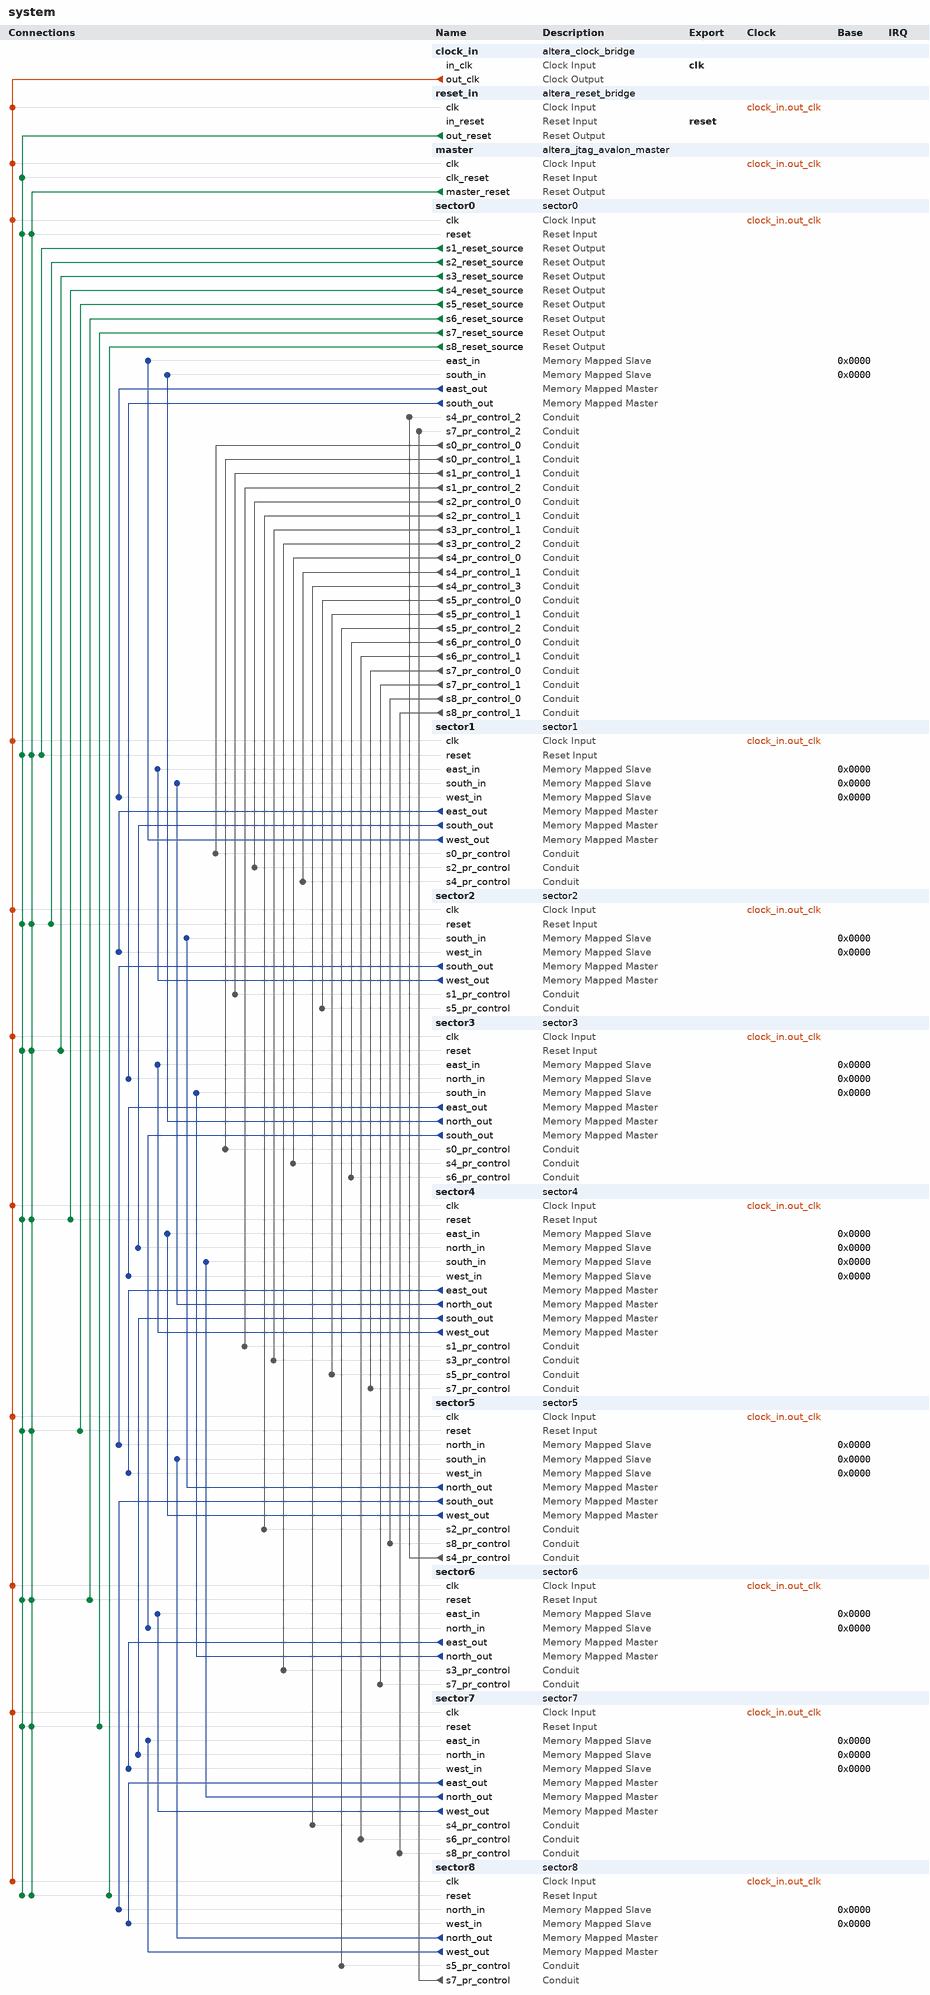
[diagram p0: system contents]
# Platform Designer (Qsys) system system, Stratix 10 1SG280HU2F50E2VGS1
# Parameters at their usual value, and those the tool derives, are not listed.
package require -exact qsys 1.0
create_system system
set_project_property DEVICE_FAMILY {Stratix 10}
set_project_property DEVICE 1SG280HU2F50E2VGS1

add_component clock_in ip/system/system_clock_in.ip altera_clock_bridge clock_in 18.0
load_component clock_in
set_component_parameter_value DERIVED_CLOCK_RATE 0
set_component_parameter_value EXPLICIT_CLOCK_RATE 50000000
save_component

add_component reset_in ip/system/system_reset_bridge_0.ip altera_reset_bridge reset_in 18.0
load_component reset_in
set_component_parameter_value ACTIVE_LOW_RESET 1
set_component_parameter_value SYNCHRONOUS_EDGES deassert
set_component_parameter_value SYNC_RESET 0
save_component

add_component master ip/system/system_master_1.ip altera_jtag_avalon_master master 18.0
load_component master
save_component

add_component sector0 sector0.qsys sector0 sector0 

add_component sector1 sector1.qsys sector1 sector1 

add_component sector2 sector2.qsys sector2 sector2 

add_component sector3 sector3.qsys sector3 sector3 

add_component sector4 sector4.qsys sector4 sector4 

add_component sector5 sector5.qsys sector5 sector5 

add_component sector6 sector6.qsys sector6 sector6 

add_component sector7 sector7.qsys sector7 sector7 

add_component sector8 sector8.qsys sector8 sector8 

# connections
add_connection clock_in.out_clk master.clk clock
add_connection clock_in.out_clk reset_in.clk clock
add_connection clock_in.out_clk sector0.clk clock
add_connection clock_in.out_clk sector1.clk clock
add_connection clock_in.out_clk sector2.clk clock
add_connection clock_in.out_clk sector3.clk clock
add_connection clock_in.out_clk sector4.clk clock
add_connection clock_in.out_clk sector5.clk clock
add_connection clock_in.out_clk sector6.clk clock
add_connection clock_in.out_clk sector7.clk clock
add_connection clock_in.out_clk sector8.clk clock
add_connection master.master_reset sector0.reset reset
add_connection master.master_reset sector1.reset reset
add_connection master.master_reset sector2.reset reset
add_connection master.master_reset sector3.reset reset
add_connection master.master_reset sector4.reset reset
add_connection master.master_reset sector5.reset reset
add_connection master.master_reset sector6.reset reset
add_connection master.master_reset sector7.reset reset
add_connection master.master_reset sector8.reset reset
add_connection reset_in.out_reset master.clk_reset reset
add_connection reset_in.out_reset sector0.reset reset
add_connection reset_in.out_reset sector1.reset reset
add_connection reset_in.out_reset sector2.reset reset
add_connection reset_in.out_reset sector3.reset reset
add_connection reset_in.out_reset sector4.reset reset
add_connection reset_in.out_reset sector5.reset reset
add_connection reset_in.out_reset sector6.reset reset
add_connection reset_in.out_reset sector7.reset reset
add_connection reset_in.out_reset sector8.reset reset
add_connection sector0.s1_reset_source sector1.reset reset
add_connection sector0.s2_reset_source sector2.reset reset
add_connection sector0.s3_reset_source sector3.reset reset
add_connection sector0.s4_reset_source sector4.reset reset
add_connection sector0.s5_reset_source sector5.reset reset
add_connection sector0.s6_reset_source sector6.reset reset
add_connection sector0.s7_reset_source sector7.reset reset
add_connection sector0.s8_reset_source sector8.reset reset
add_connection sector0.east_out sector1.west_in avalon
set_connection_parameter_value sector0.east_out/sector1.west_in baseAddress 0x0000
add_connection sector0.south_out sector3.north_in avalon
set_connection_parameter_value sector0.south_out/sector3.north_in baseAddress 0x0000
add_connection sector1.east_out sector2.west_in avalon
set_connection_parameter_value sector1.east_out/sector2.west_in baseAddress 0x0000
add_connection sector1.south_out sector4.north_in avalon
set_connection_parameter_value sector1.south_out/sector4.north_in baseAddress 0x0000
add_connection sector1.west_out sector0.east_in avalon
set_connection_parameter_value sector1.west_out/sector0.east_in baseAddress 0x0000
add_connection sector2.south_out sector5.north_in avalon
set_connection_parameter_value sector2.south_out/sector5.north_in baseAddress 0x0000
add_connection sector2.west_out sector1.east_in avalon
set_connection_parameter_value sector2.west_out/sector1.east_in baseAddress 0x0000
add_connection sector3.east_out sector4.west_in avalon
set_connection_parameter_value sector3.east_out/sector4.west_in baseAddress 0x0000
add_connection sector3.north_out sector0.south_in avalon
set_connection_parameter_value sector3.north_out/sector0.south_in baseAddress 0x0000
add_connection sector3.south_out sector6.north_in avalon
set_connection_parameter_value sector3.south_out/sector6.north_in baseAddress 0x0000
add_connection sector4.east_out sector5.west_in avalon
set_connection_parameter_value sector4.east_out/sector5.west_in baseAddress 0x0000
add_connection sector4.north_out sector1.south_in avalon
set_connection_parameter_value sector4.north_out/sector1.south_in baseAddress 0x0000
add_connection sector4.south_out sector7.north_in avalon
set_connection_parameter_value sector4.south_out/sector7.north_in baseAddress 0x0000
add_connection sector4.west_out sector3.east_in avalon
set_connection_parameter_value sector4.west_out/sector3.east_in baseAddress 0x0000
add_connection sector5.north_out sector2.south_in avalon
set_connection_parameter_value sector5.north_out/sector2.south_in baseAddress 0x0000
add_connection sector5.south_out sector8.north_in avalon
set_connection_parameter_value sector5.south_out/sector8.north_in baseAddress 0x0000
add_connection sector5.west_out sector4.east_in avalon
set_connection_parameter_value sector5.west_out/sector4.east_in baseAddress 0x0000
add_connection sector6.east_out sector7.west_in avalon
set_connection_parameter_value sector6.east_out/sector7.west_in baseAddress 0x0000
add_connection sector6.north_out sector3.south_in avalon
set_connection_parameter_value sector6.north_out/sector3.south_in baseAddress 0x0000
add_connection sector7.east_out sector8.west_in avalon
set_connection_parameter_value sector7.east_out/sector8.west_in baseAddress 0x0000
add_connection sector7.north_out sector4.south_in avalon
set_connection_parameter_value sector7.north_out/sector4.south_in baseAddress 0x0000
add_connection sector7.west_out sector6.east_in avalon
set_connection_parameter_value sector7.west_out/sector6.east_in baseAddress 0x0000
add_connection sector8.north_out sector5.south_in avalon
set_connection_parameter_value sector8.north_out/sector5.south_in baseAddress 0x0000
add_connection sector8.west_out sector7.east_in avalon
set_connection_parameter_value sector8.west_out/sector7.east_in baseAddress 0x0000
add_connection sector0.s0_pr_control_0 sector1.s0_pr_control conduit
add_connection sector0.s0_pr_control_1 sector3.s0_pr_control conduit
add_connection sector0.s1_pr_control_1 sector2.s1_pr_control conduit
add_connection sector0.s1_pr_control_2 sector4.s1_pr_control conduit
add_connection sector0.s2_pr_control_0 sector1.s2_pr_control conduit
add_connection sector0.s2_pr_control_1 sector5.s2_pr_control conduit
add_connection sector0.s3_pr_control_1 sector4.s3_pr_control conduit
add_connection sector0.s3_pr_control_2 sector6.s3_pr_control conduit
add_connection sector0.s4_pr_control_0 sector3.s4_pr_control conduit
add_connection sector0.s4_pr_control_1 sector1.s4_pr_control conduit
add_connection sector0.s4_pr_control_3 sector7.s4_pr_control conduit
add_connection sector0.s5_pr_control_0 sector2.s5_pr_control conduit
add_connection sector0.s5_pr_control_1 sector4.s5_pr_control conduit
add_connection sector0.s5_pr_control_2 sector8.s5_pr_control conduit
add_connection sector0.s6_pr_control_0 sector3.s6_pr_control conduit
add_connection sector0.s6_pr_control_1 sector7.s6_pr_control conduit
add_connection sector0.s7_pr_control_0 sector4.s7_pr_control conduit
add_connection sector0.s7_pr_control_1 sector6.s7_pr_control conduit
add_connection sector0.s8_pr_control_0 sector5.s8_pr_control conduit
add_connection sector0.s8_pr_control_1 sector7.s8_pr_control conduit
add_connection sector5.s4_pr_control sector0.s4_pr_control_2 conduit
add_connection sector8.s7_pr_control sector0.s7_pr_control_2 conduit

# exported interfaces
add_interface clk clock sink
set_interface_property clk EXPORT_OF clock_in.in_clk
add_interface reset reset sink
set_interface_property reset EXPORT_OF reset_in.in_reset

set_interconnect_requirement {$system} qsys_mm.clockCrossingAdapter HANDSHAKE
set_interconnect_requirement {$system} qsys_mm.enableEccProtection FALSE
set_interconnect_requirement {$system} qsys_mm.insertDefaultSlave FALSE
set_interconnect_requirement {$system} qsys_mm.maxAdditionalLatency 4

save_system system.qsys
